# EAGLE design ControlPCB_v3 (EAGLE 9.7.0)
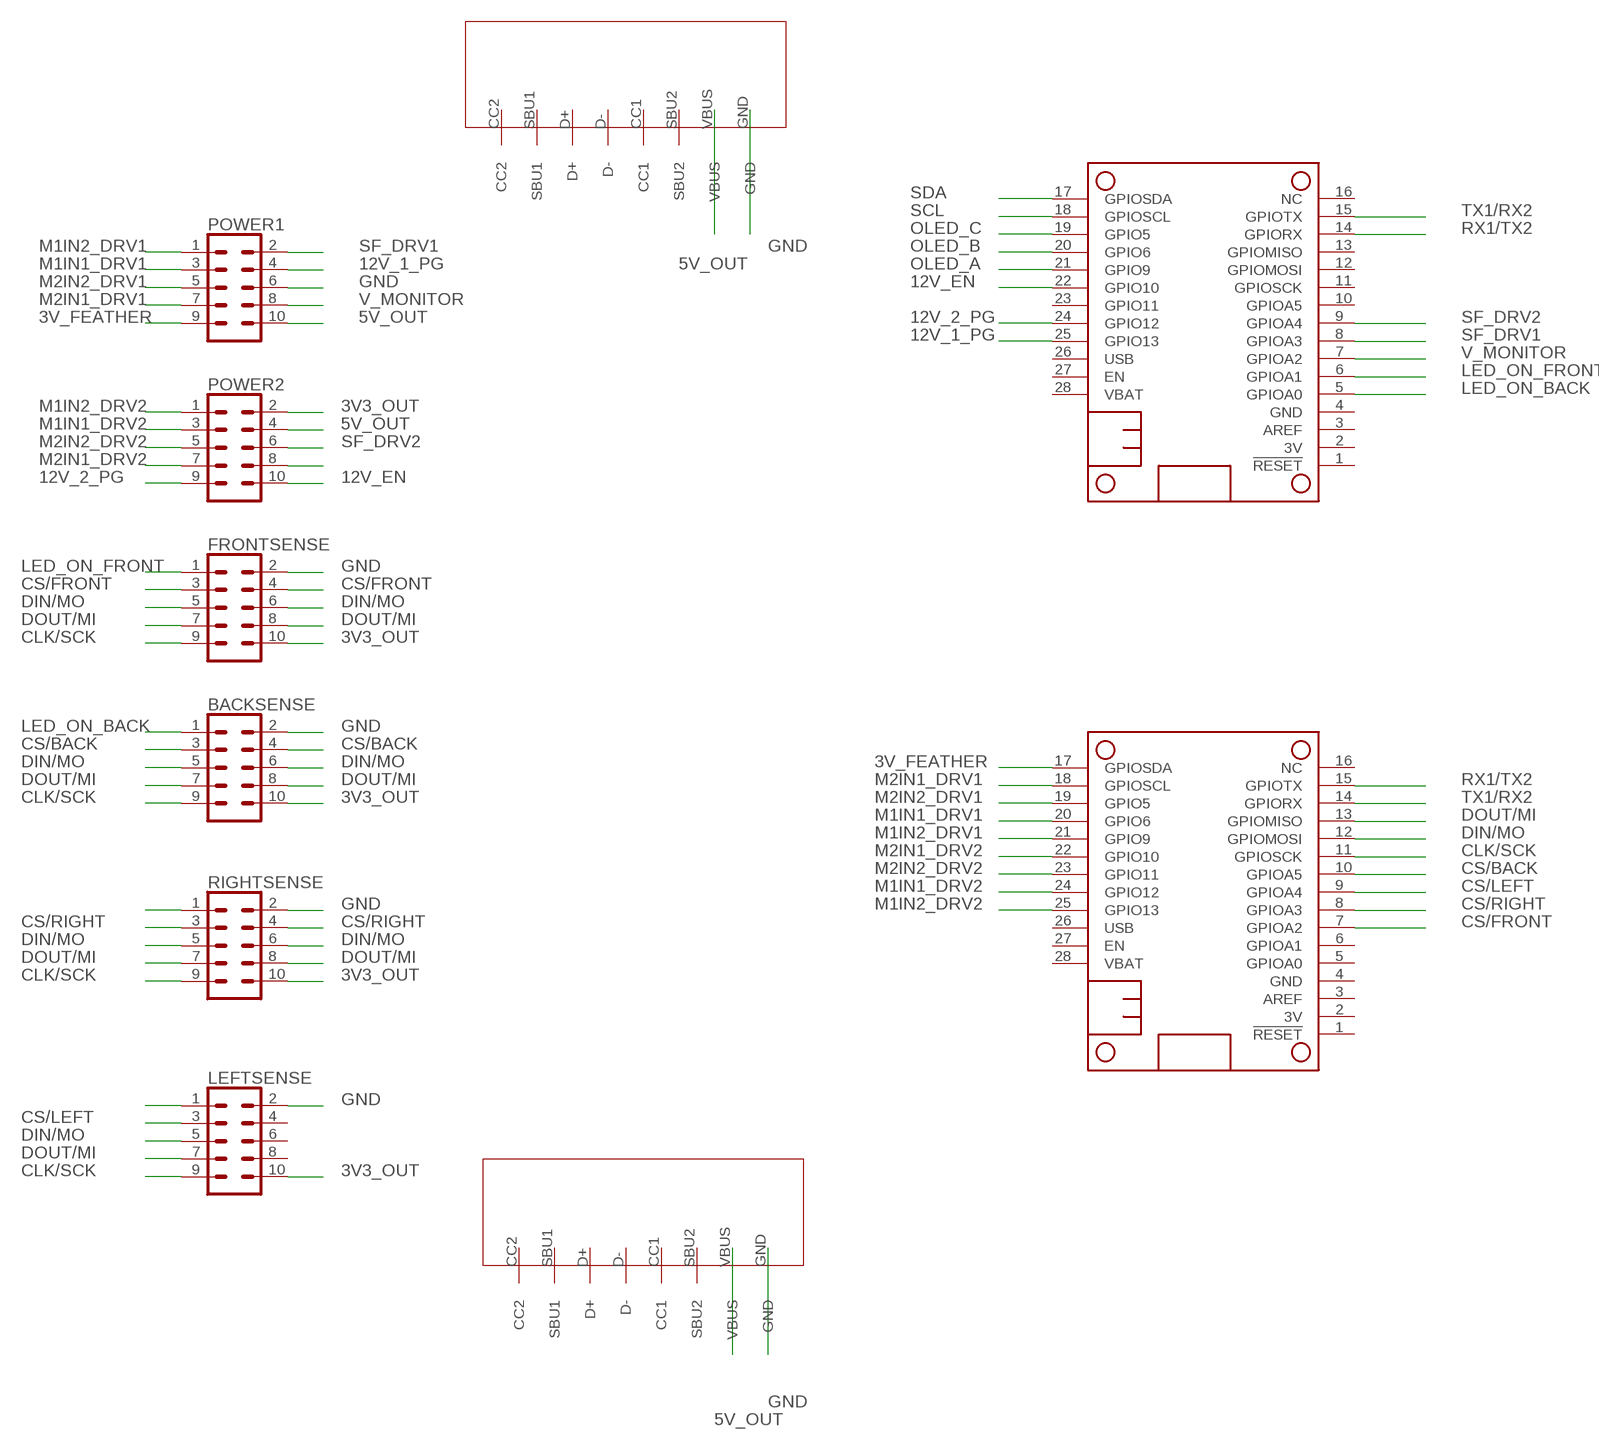
[diagram p0: schematic, sheet 1]

## Parts
BACKSENSE  CONN_05X2SHD  [2X5-SHROUDED]
FRONTSENSE  CONN_05X2SHD  [2X5-SHROUDED]
LEFTSENSE  CONN_05X2SHD  [2X5-SHROUDED]
MS3  CUSTOM_FEATHER  [FEATHERWING]
MS4  CUSTOM_FEATHER  [FEATHERWING]
POWER1  CONN_05X2SHD  [2X5-SHROUDED]
POWER2  CONN_05X2SHD  [2X5-SHROUDED]
RIGHTSENSE  CONN_05X2SHD  [2X5-SHROUDED]
U$1  CUSTOM_USBC_BRKOUT  [CUSTOM_USBC_BRKOUT]
U$2  CUSTOM_USBC_BRKOUT  [CUSTOM_USBC_BRKOUT]

## Nets
3V3_OUT: BACKSENSE.10 FRONTSENSE.10 LEFTSENSE.10 POWER2.2 RIGHTSENSE.10
3V_FEATHER: MS4.17(GPIOSDA) POWER1.9
5V_OUT: POWER1.10 POWER2.4 U$1.VBUS U$2.VBUS
12V_1_PG: MS3.25(GPIO13) POWER1.4
12V_2_PG: MS3.24(GPIO12) POWER2.9
12V_EN: MS3.22(GPIO10) POWER2.10
CLK/SCK: BACKSENSE.9 FRONTSENSE.9 LEFTSENSE.9 MS4.11(GPIOSCK) RIGHTSENSE.9
CS/BACK: BACKSENSE.3 BACKSENSE.4 MS4.10(GPIOA5)
CS/FRONT: FRONTSENSE.3 FRONTSENSE.4 MS4.7(GPIOA2)
CS/LEFT: LEFTSENSE.3 MS4.9(GPIOA4)
CS/RIGHT: MS4.8(GPIOA3) RIGHTSENSE.3 RIGHTSENSE.4
DIN/MO: BACKSENSE.5 BACKSENSE.6 FRONTSENSE.5 FRONTSENSE.6 LEFTSENSE.5 MS4.12(GPIOMOSI) RIGHTSENSE.5 RIGHTSENSE.6
DOUT/MI: BACKSENSE.7 BACKSENSE.8 FRONTSENSE.7 FRONTSENSE.8 LEFTSENSE.7 MS4.13(GPIOMISO) RIGHTSENSE.7 RIGHTSENSE.8
GND: BACKSENSE.2 FRONTSENSE.2 LEFTSENSE.2 POWER1.6 RIGHTSENSE.2 U$1.GND U$2.GND
LED_ON_BACK: BACKSENSE.1 MS3.5(GPIOA0)
LED_ON_FRONT: FRONTSENSE.1 MS3.6(GPIOA1)
M1IN1_DRV1: MS4.20(GPIO6) POWER1.3
M1IN1_DRV2: MS4.24(GPIO12) POWER2.3
M1IN2_DRV1: MS4.21(GPIO9) POWER1.1
M1IN2_DRV2: MS4.25(GPIO13) POWER2.1
M2IN1_DRV1: MS4.18(GPIOSCL) POWER1.7
M2IN1_DRV2: MS4.22(GPIO10) POWER2.7
M2IN2_DRV1: MS4.19(GPIO5) POWER1.5
M2IN2_DRV2: MS4.23(GPIO11) POWER2.5
N$17: POWER2.8
N$41: RIGHTSENSE.1
N$60: LEFTSENSE.1
OLED_A: MS3.21(GPIO9)
OLED_B: MS3.20(GPIO6)
OLED_C: MS3.19(GPIO5)
RX1/TX2: MS3.14(GPIORX) MS4.15(GPIOTX)
SCL: MS3.18(GPIOSCL)
SDA: MS3.17(GPIOSDA)
SF_DRV1: MS3.8(GPIOA3) POWER1.2
SF_DRV2: MS3.9(GPIOA4) POWER2.6
TX1/RX2: MS3.15(GPIOTX) MS4.14(GPIORX)
V_MONITOR: MS3.7(GPIOA2) POWER1.8
Unconnected: LEFTSENSE.4 LEFTSENSE.6 LEFTSENSE.8 MS3.1(!RESET) MS3.2(3V) MS3.3(AREF) MS3.10(GPIOA5) MS3.11(GPIOSCK) MS3.12(GPIOMOSI) MS3.13(GPIOMISO) MS3.16(NC) MS3.23(GPIO11) MS3.26(USB) MS3.27(EN) MS3.28(VBAT) MS4.1(!RESET) MS4.2(3V) MS4.3(AREF) MS4.5(GPIOA0) MS4.6(GPIOA1) MS4.16(NC) MS4.26(USB) MS4.27(EN) MS4.28(VBAT) U$1.CC1 U$1.CC2 U$1.D+ U$1.D- U$1.SBU1 U$1.SBU2 U$2.CC1 U$2.CC2 U$2.D+ U$2.D- U$2.SBU1 U$2.SBU2

## Power pins joined to a net without a drawn wire
GND: MS3.4(GND) MS4.4(GND)

## Library data of the parts
BACKSENSE FRONTSENSE LEFTSENSE POWER1 POWER2 RIGHTSENSE = SparkFun-Connectors:CONN_05X2: Multi connection point. Often used as Generic Header-pin footprint for 0.1 inch spaced/style header connections For AVR SPI programming port, see special device with nice symbol: "AVR_SPI_PROG_5x2.dev" You can populate with any combo of single row headers, but if you'd like an exact match, check these: 2x5 AVR ICSP Male Header <https://www.sparkfun.com/products/778> (PRT-00778) 2x5 Pin Shrouded Header <https://www.sparkfun.com/products/8506> (PRT-08506) On any of the 0.1 inch spaced packages, you can populate with these: Break Away Headers - Straight <https://www.sparkfun.com/products/116> (PRT-00116) Break Away Male Headers - Right Angle <https://www.sparkfun.com/products/553> (PRT-00553) Female Headers <https://www.sparkfun.com/products/115> (PRT-00115) Break Away Headers - Machine Pin <https://www.sparkfun.com/products/117> (PRT-00117) Break Away Female Headers - Swiss Machine Pin <https://www.sparkfun.com/products/743> (PRT-00743) Special note: the shrouded connector mates well with our 5x2 ribbon cables: 2x5 Pin IDC Ribbon Cable <https://www.sparkfun.com/products/8535> (PRT-08535); PROD_ID: CONN-08671; SF_ID: PRT-08506
MS3 MS4 = Custom_Feather:CUSTOM_FEATHER
U$1 U$2 = Custom_UBC_BRKOUT:CUSTOM_USBC_BRKOUT

## Board
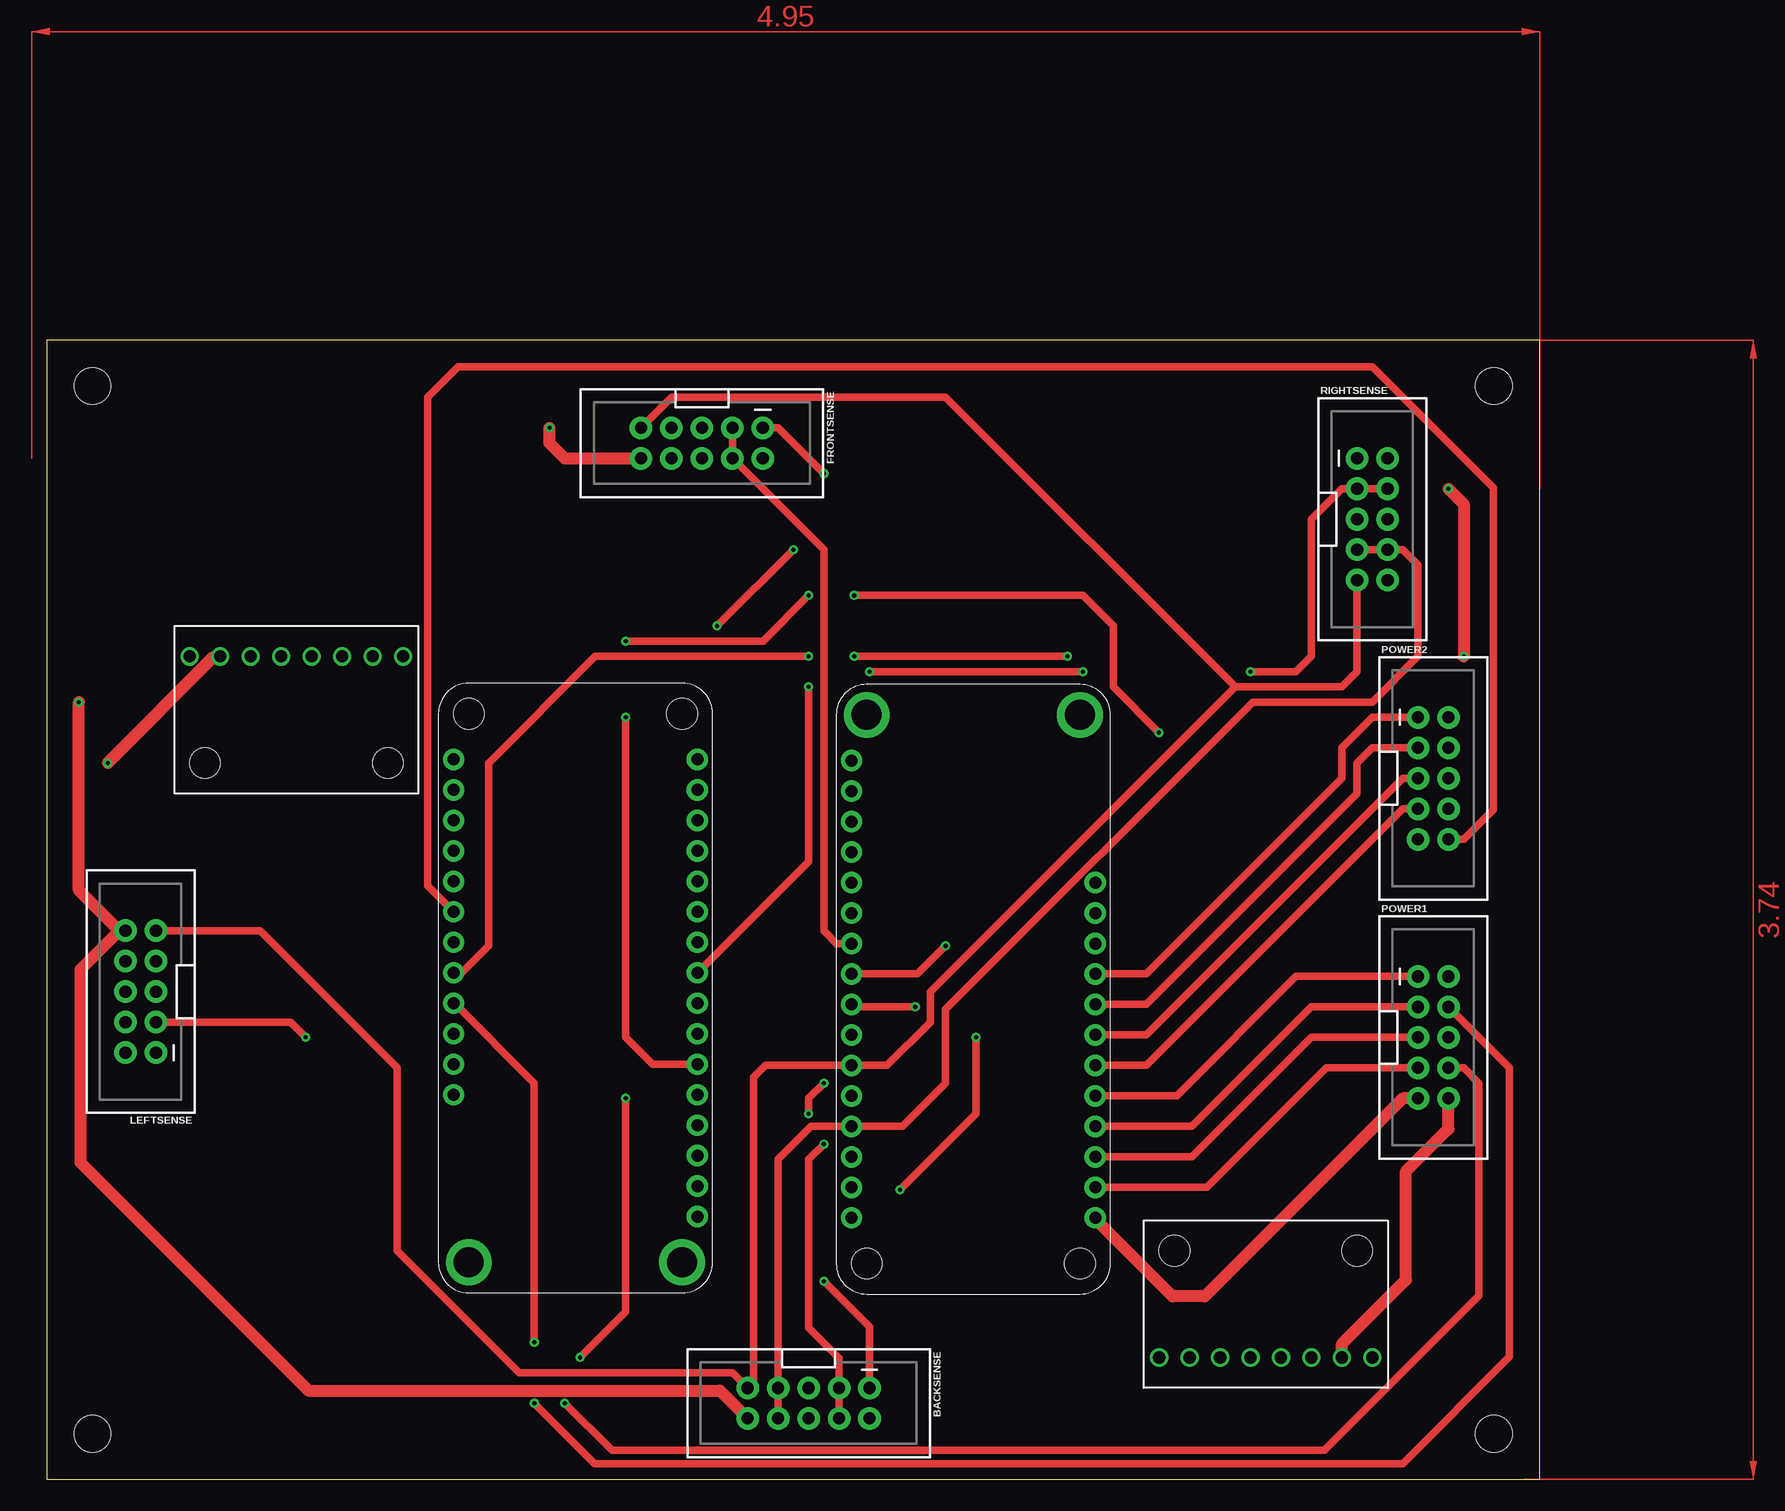
[diagram p1: board, top side]
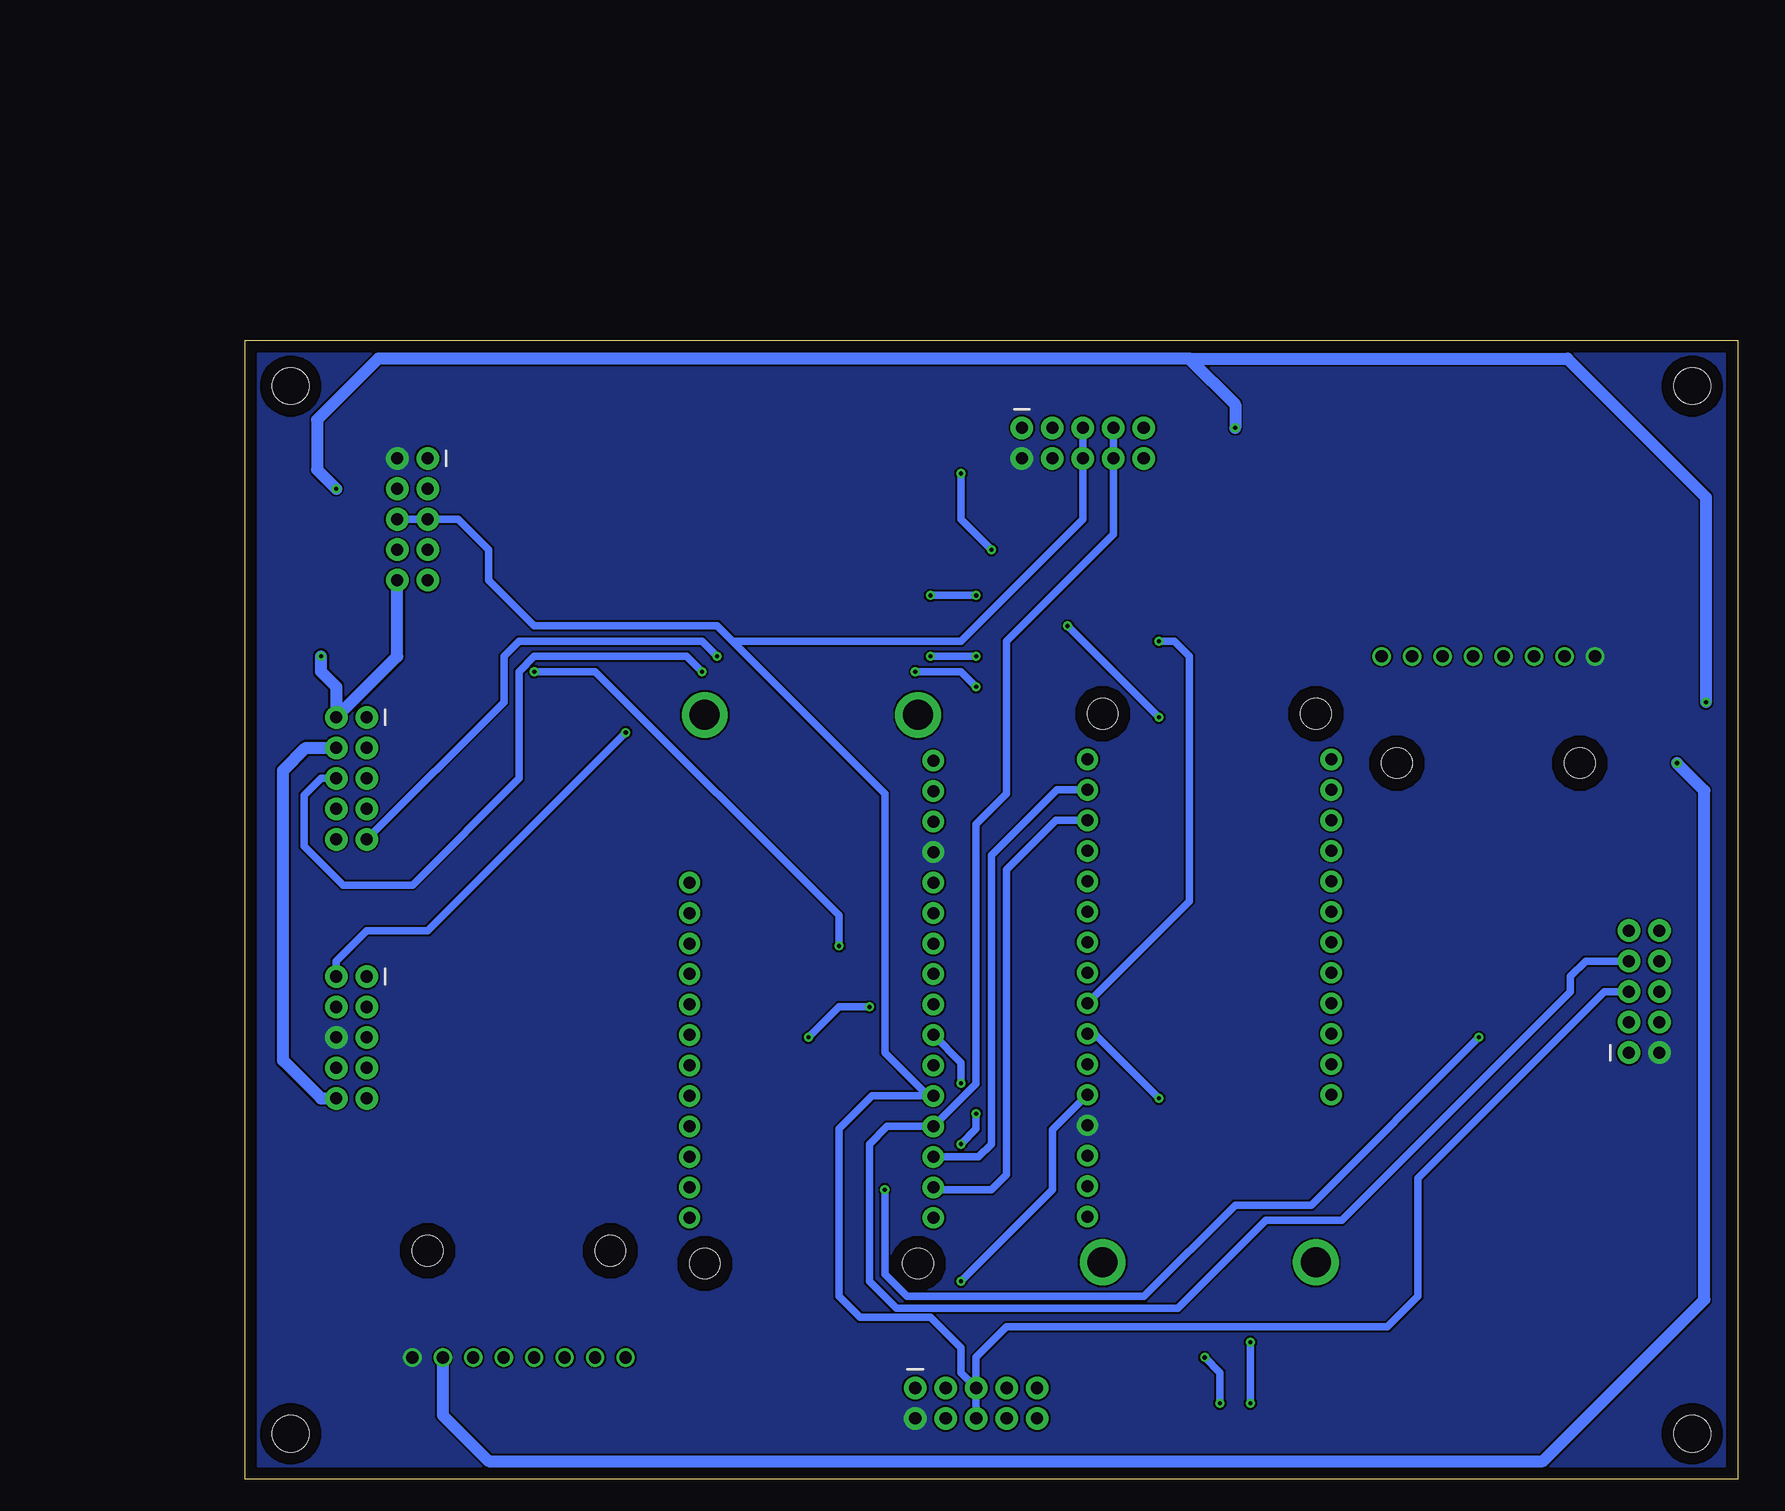
[diagram p2: board, bottom side, seen from below]

Size 124.44 x 94.92 mm. Coordinates in mm from the lower left corner, seen from the top.
Outline: 0,0 124.44,0 124.44,94.92 0,94.92 0,0
Copper layers (1*16): Top / Bottom
Stack-up Default Layer Stack: Top User Defined 0.035mm / Dielectric-1 User Defined 1.5mm / Bottom User Defined 0.035mm
Design rules: minimum copper width 6mil, minimum drill size 0.35mm, copper clearance wire_polygon to wire_polygon 6mil, copper clearance wire_polygon to pad_smd 6mil, copper clearance wire_polygon to via 6mil, copper clearance pad_smd to pad_smd 6mil, copper clearance pad_smd to via 6mil, copper clearance via to via 6mil, copper clearance smd to pad (same net) 6mil, copper clearance smd to via (same net) 6mil, copper clearance smd to smd (same net) 6mil, dimension clearance 40mil, via restrict clearance 0mil, restrict clearance 0mil, drill distance 6mil, keepout clearance 0mil
Holes 3.05 mm at 3.81,91.11 120.63,91.11 120.63,3.81 3.81,3.81

### Footprints (pad centres in the part's own frame; a part is rotated, then mirrored left to right if it is on the bottom)
2X5-SHROUDED = drill 1.016 pad 1.88: 1 -1.27,5.08; 2 1.27,5.08; 3 -1.27,2.54; 4 1.27,2.54; 5 -1.27,0; 6 1.27,0; 7 -1.27,-2.54; 8 1.27,-2.54; 9 -1.27,-5.08; 10 1.27,-5.08
FEATHERWING = drill 1 pad 1.778: 1 6.35,1.27; 2 8.89,1.27; 3 11.43,1.27; 4 13.97,1.27; 5 16.51,1.27; 6 19.05,1.27; 7 21.59,1.27; 8 24.13,1.27; 9 26.67,1.27; 10 29.21,1.27; 11 31.75,1.27; 12 34.29,1.27; 13 36.83,1.27; 14 39.37,1.27; 15 41.91,1.27; 16 44.45,1.27; 17 44.45,21.59; 18 41.91,21.59; 19 39.37,21.59; 20 36.83,21.59; 21 34.29,21.59; 22 31.75,21.59; 23 29.21,21.59; 24 26.67,21.59; 25 24.13,21.59; 26 21.59,21.59; 27 19.05,21.59; 28 16.51,21.59 | drill 2.5 pad 3.81: P$1 2.54,20.32; P$2 2.54,2.54 | hole 2.54: 48.26,20.32; 48.26,2.54
CUSTOM_USBC_BRKOUT = drill 1.016: CC1 11.43,2.54; CC2 1.27,2.54; D+ 6.35,2.54; D- 8.89,2.54; GND 19.05,2.54; SBU1 3.81,2.54; SBU2 13.97,2.54; VBUS 16.51,2.54 | hole 2.54: 2.54,11.43; 17.78,11.43

### Placement (x,y rotation side)
BACKSENSE  63.5,6.35 270 top
FRONTSENSE  54.61,86.36 270 top
LEFTSENSE  7.82,40.64 180 top
MS3  55.5,15.55 90 top
MS4  65.8,66.24 270 top
POWER1  115.57,36.83 0 top
POWER2  115.57,58.42 0 top
RIGHTSENSE  110.49,80.01 0 top
U$1  30.97,71.12 180 top
U$2  91.45,7.62 0 top

### Tracks (layer width: path | path; a pad name or v marks a point on that pad's centre or on a via)
3V3_OUT  (via drill 0.35)
  Top 1.016: v41.91,87.63 41.91,86.36 43.18,85.09 FRONTSENSE.10 | v116.84,82.55 118.11,81.28 v118.11,68.58 | 6.04,45.72 2.66,49.1 v2.66,64.77 | 6.04,45.72 LEFTSENSE.10 | 6.04,45.72 2.79,42.47 2.79,26.42 21.82,7.39 56.11,7.39 BACKSENSE.10
  Bottom 1.016: 45.72,93.4 41.91,89.59 v41.91,87.63 | v118.11,68.58 118.11,67.31 116.84,66.04 POWER2.2 111.76,68.58 RIGHTSENSE.10 | v116.84,82.55 118.44,84.15 118.44,88.29 113.34,93.4 45.72,93.4 | 45.72,93.4 14.22,93.4 2.66,81.84 v2.66,64.77
3V_FEATHER
  Top 1.016: POWER1.9 113.03,31.75 96.52,15.24 93.85,15.24 87.39,21.7 MS4.17
5V_OUT  (via drill 0.35)
  Top 1.016: U$2.VBUS 107.96,11.29 113.29,16.62 113.29,25.66 116.84,29.21 POWER1.10 | v5.08,59.69 13.97,68.58 U$1.VBUS
  Bottom 1.016: U$2.VBUS 107.96,5.34 104.14,1.52 16.26,1.52 2.79,14.99 2.79,57.4 v5.08,59.69 | POWER1.10 118.11,31.75 121.28,34.92 121.28,59.05 119.38,60.96 POWER2.4
12V_1_PG  (via drill 0.35)
  Top 0.61: POWER1.4 121.92,34.29 121.92,10.21 113.03,1.32 45.67,1.32 v40.64,6.35 | v40.64,11.43 40.64,33.02 33.99,39.67 MS3.25
  Bottom 0.61: v40.64,6.35 v40.64,11.43
12V_2_PG  (via drill 0.35)
  Top 0.61: v85.09,68.58 v67.31,68.58 | v63.5,68.58 45.72,68.58 36.83,59.69 36.83,44.45 34.6,42.21 MS3.24
  Bottom 0.61: POWER2.9 102.87,64.77 102.87,68.58 101.6,69.85 86.36,69.85 v85.09,68.58 | v63.5,68.58 v67.31,68.58
12V_EN
  Top 0.61: MS3.22 31.75,49.45 31.75,90.17 34.29,92.71 110.49,92.71 120.58,82.62 120.58,55.81 118.11,53.34 POWER2.10
CLK/SCK
  Top 0.61: 99.06,66.04 74.93,90.17 52.07,90.17 FRONTSENSE.9 | 99.06,66.04 73.66,40.64 73.66,38.1 70.05,34.49 MS4.11 59.9,34.49 58.93,33.53 58.93,8.13 BACKSENSE.9 57.15,8.89 39.37,8.89 29.21,19.05 29.21,34.29 17.78,45.72 LEFTSENSE.9 | 99.06,66.04 107.95,66.04 109.22,67.31 RIGHTSENSE.9
CS/BACK  (via drill 0.35)
  Top 0.61: v64.77,27.94 63.5,26.67 63.5,12.62 66.04,10.08 BACKSENSE.3 BACKSENSE.4 | v63.5,30.48 63.5,31.75 v64.77,33.02
  Bottom 0.61: v64.77,27.94 63.5,29.21 v63.5,30.48 | v64.77,33.02 64.77,34.73 MS4.10
CS/FRONT
  Top 0.61: MS4.7 65.83,44.66 64.77,45.72 64.77,77.47 FRONTSENSE.4 FRONTSENSE.3
CS/LEFT  (via drill 0.35)
  Top 0.61: v71.12,24.13 77.47,30.48 v77.47,36.83 | v72.39,39.37 67.28,39.37 MS4.9 | v21.59,36.83 20.32,38.1 LEFTSENSE.3
  Bottom 0.61: v21.59,36.83 35.56,22.86 41.91,22.86 49.53,15.24 69.26,15.24 71.12,17.1 v71.12,24.13 | v77.47,36.83 74.93,39.37 v72.39,39.37
CS/RIGHT  (via drill 0.35)
  Top 0.61: v100.33,67.31 104.14,67.31 105.41,68.58 105.41,80.01 107.95,82.55 RIGHTSENSE.3 RIGHTSENSE.4 | v74.93,44.45 72.59,42.12 MS4.8
  Bottom 0.61: v74.93,44.45 74.93,46.99 95.25,67.31 v100.33,67.31
DIN/MO
  Bottom 0.61: 83.82,69.85 64.77,69.85 54.61,80.01 FRONTSENSE.6 FRONTSENSE.5 | 83.82,69.85 85.09,71.12 100.33,71.12 104.14,74.93 104.14,77.47 106.68,80.01 RIGHTSENSE.5 RIGHTSENSE.6 | 83.82,69.85 71.12,57.15 71.12,35.56 67.52,31.95 MS4.12 72.19,31.95 74.93,29.21 74.93,15.24 73.2,13.51 67.31,13.51 64.77,10.97 64.77,8.89 BACKSENSE.5 | LEFTSENSE.5 11.12,40.64 26.67,25.09 26.67,15.24 29.21,12.7 60.96,12.7 63.5,10.16 BACKSENSE.5 | BACKSENSE.5 BACKSENSE.6
DOUT/MI
  Top 0.61: BACKSENSE.8 BACKSENSE.7 60.96,26.67 63.71,29.41 MS4.13 71.33,29.41 74.93,33.02 74.93,39.18 100.52,64.77 110.49,64.77 114.3,68.58 114.3,76.2 113.03,77.47 RIGHTSENSE.8 RIGHTSENSE.7
  Bottom 0.61: LEFTSENSE.7 12.7,43.18 13.97,41.91 13.97,40.64 33.02,21.59 39.37,21.59 46.69,14.27 70.16,14.27 72.39,16.51 72.39,27.94 70.91,29.41 MS4.13 63.5,32.99 63.5,54.61 60.96,57.15 60.96,69.85 52.07,78.74 FRONTSENSE.8 FRONTSENSE.7
GND
  pour Bottom (no thermals): -3.81,96.52 128.27,96.52 128.27,-2.54 -3.81,-2.54
LED_ON_BACK  (via drill 0.35)
  Top 0.61: BACKSENSE.1 68.58,12.7 v64.77,16.51
  Bottom 0.61: v64.77,16.51 57.15,24.13 57.15,29.13 MS3.5
LED_ON_FRONT  (via drill 0.35)
  Top 0.61: FRONTSENSE.1 60.96,87.63 v64.77,83.82 | v62.23,77.47 v55.88,71.12 | v48.26,63.5 48.26,36.83 50.5,34.59 MS3.6
  Bottom 0.61: v64.77,83.82 64.77,80.01 v62.23,77.47 | v55.88,71.12 v48.26,63.5
M1IN1_DRV1
  Top 0.61: MS4.20 95.45,29.41 105.41,39.37 POWER1.3
M1IN1_DRV2
  Top 0.61: MS4.24 91.64,39.57 109.22,57.15 109.22,59.69 110.49,60.96 POWER2.3
M1IN2_DRV1
  Top 0.61: MS4.21 94.19,31.95 104.14,41.91 POWER1.1
M1IN2_DRV2
  Top 0.61: MS4.25 91.64,42.12 107.95,58.42 107.95,60.96 110.49,63.5 POWER2.1
M2IN1_DRV1
  Top 0.61: MS4.18 96.72,24.34 106.68,34.29 POWER1.7
M2IN1_DRV2
  Top 0.61: MS4.22 91.64,34.49 113.03,55.88 POWER2.7
M2IN2_DRV1
  Top 0.61: MS4.19 95.45,26.88 105.41,36.83 POWER1.5
M2IN2_DRV2
  Top 0.61: MS4.23 91.64,37.03 113.03,58.42 POWER2.5
RX1/TX2
  Bottom 0.61: MS3.14 56.85,54.91 60.96,50.8 60.96,25.4 62.23,24.13 66.87,24.13 MS4.15
SF_DRV1  (via drill 0.35)
  Top 0.61: v92.71,62.23 88.9,66.04 88.9,71.12 86.36,73.66 v67.31,73.66 | v63.5,73.66 59.69,69.85 v48.26,69.85
  Bottom 0.61: POWER1.2 116.84,43.18 114.3,45.72 109.22,45.72 v92.71,62.23 | v67.31,73.66 v63.5,73.66 | v48.26,69.85 46.99,69.85 45.72,68.58 45.72,48.18 MS3.8
SF_DRV2  (via drill 0.35)
  Top 0.61: v86.36,67.31 v68.58,67.31 | v63.5,66.04 63.5,51.49 MS3.9
  Bottom 0.61: v86.36,67.31 87.63,68.58 100.33,68.58 101.6,67.31 101.6,58.42 110.49,49.53 116.28,49.53 119.51,52.76 119.51,57.02 118.11,58.42 POWER2.6 | v68.58,67.31 64.77,67.31 v63.5,66.04
TX1/RX2
  Bottom 0.61: MS3.15 56.77,57.45 62.23,51.99 62.23,27.94 63.3,26.88 MS4.14
V_MONITOR  (via drill 0.35)
  Top 0.61: POWER1.8 118.11,34.29 119.38,33.02 119.38,15.29 106.5,2.41 47.12,2.41 v43.18,6.35 | v44.45,10.16 48.26,13.97 v48.26,31.75
  Bottom 0.61: v43.18,6.35 43.18,8.89 v44.45,10.16 | v48.26,31.75 53.65,37.13 MS3.7
(copper drawn outside any net)
  shapes: Top area x2